# EAGLE design CAN Traffic Teensy 3.5 rev1 (EAGLE 9.6.2)
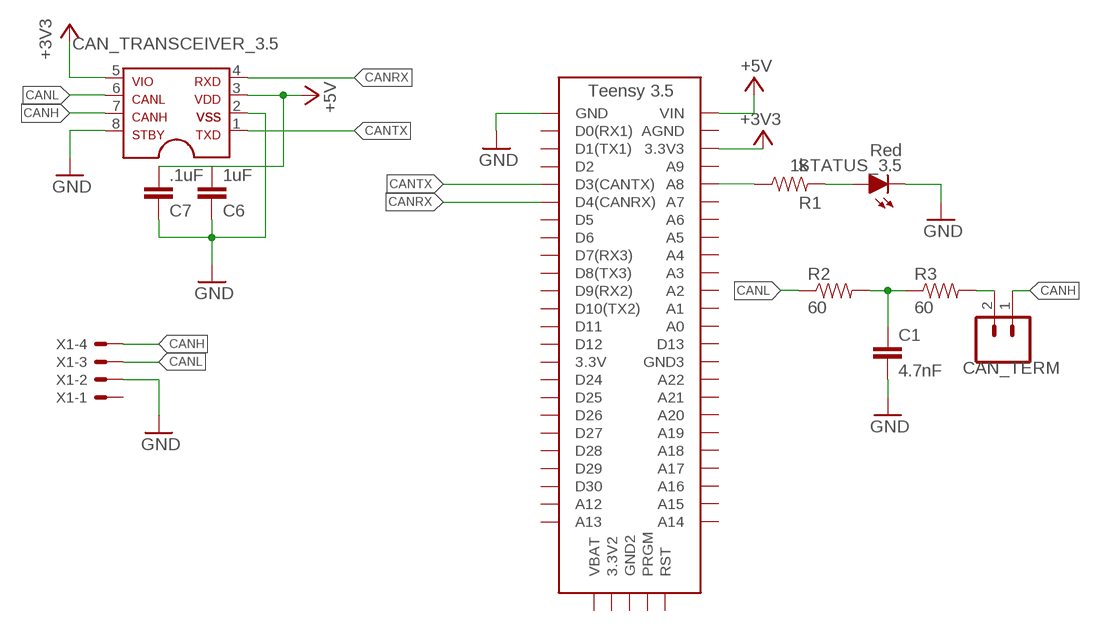
[diagram p0: schematic, sheet 1]

## Parts
3.5  TEENSY_3.5_EXT_RTC  [TEENSY_3.5_EXT_RTC]
C1  4.7nF  CAP0603-CAP  [0603-CAP]
C6  1uF  CAP0603-CAP  [0603-CAP]
C7  .1uF  CAP0603-CAP  [0603-CAP]
CAN_TERM  M02_SLIM  [1X02_SLIM]
CAN_TRANSCEIVER_3.5  MCP2562SOIC-08  [SOIC-08]
R1  1k  RESISTOR0603-RES  [0603-RES]
R2  60  RESISTOR0603-RES  [0603-RES]
R3  60  RESISTOR0603-RES  [0603-RES]
STATUS_3.5  Red  LED-0603  [LED-603]
X1  CONNECTOR-4NANO-FIT_RIGHT_ANGLE-4-SURFACE  [NANO-FIT_RIGHT_ANGLE-4-SURFACE]

## Nets
+3V3: 3.5.3.3V3 CAN_TRANSCEIVER_3.5.5
+5V: 3.5.VIN C6.1 C7.1 CAN_TRANSCEIVER_3.5.3
CANH: CAN_TERM.1 CAN_TRANSCEIVER_3.5.7 X1.4
CANL: CAN_TRANSCEIVER_3.5.6 R2.1 X1.3
CANRX: 3.5.D4(CANRX) CAN_TRANSCEIVER_3.5.4
CANTX: 3.5.D3(CANTX) CAN_TRANSCEIVER_3.5.1
GND: 3.5.GND C1.2 C6.2 C7.2 CAN_TRANSCEIVER_3.5.2 CAN_TRANSCEIVER_3.5.8 STATUS_3.5.C X1.2
N$1: 3.5.A8 R1.1
N$2: C1.1 R2.2 R3.1
N$3: R1.2 STATUS_3.5.A
N$5: CAN_TERM.2 R3.2
Unconnected: 3.5.3.3V 3.5.3.3V2 3.5.A0 3.5.A1 3.5.A2 3.5.A3 3.5.A4 3.5.A5 3.5.A6 3.5.A7 3.5.A9 3.5.A12 3.5.A13 3.5.A14 3.5.A15 3.5.A16 3.5.A17 3.5.A18 3.5.A19 3.5.A20 3.5.A21 3.5.A22 3.5.AGND 3.5.D0(RX1) 3.5.D1(TX1) 3.5.D2 3.5.D5 3.5.D6 3.5.D7(RX3) 3.5.D8(TX3) 3.5.D9(RX2) 3.5.D10(TX2) 3.5.D11 3.5.D12 3.5.D13 3.5.D24 3.5.D25 3.5.D26 3.5.D27 3.5.D28 3.5.D29 3.5.D30 3.5.GND2 3.5.GND3 3.5.PRGM 3.5.RST 3.5.VBAT X1.1

## Library data of the parts
3.5 = HyTechDevices:TEENSY_3.5_EXT_RTC: Extended version of the Teensy 3.5 board that only uses the 2 main rows of pins, plus the perpendicular row with VBat.
C1 C6 C7 = HyTechDevices:CAP: Capacitor Standard 0603 ceramic capacitor, and 0.1" leaded capacitor.
CAN_TERM = HyTechDevices:M02: Standard 2-pin 0.1" header. NOTES ON THE VARIANTS LOCK and LOCK_LONGPADS... This footprint was designed to help hold the alignment of a through-hole component (i.e. 6-pin header) while soldering it into place. You may notice that each hole has been shifted either up or down by 0.005 of an inch from it's more standard position (which is a perfectly straight line). This slight alteration caused the pins (the squares in the middle) to touch the edges of the holes. Because they are alternating, it causes a "brace" to hold the component in place. 0.005 has proven to be the perfect amount of "off-center" position when using our standard breakaway headers. Although looks a little odd when you look at the bare footprint, once you have a header in there, the alteration is very hard to notice. Also,if you push a header all the way into place, it is covered up entirely on the bottom side. This idea of altering the position of holes to aid alignment will be further integrated into the Sparkfun Library for other footprints. It can help hold any component with 3 or more connection pins. Note: The Sparkfun version includes many other packages including surface mount that may be of future interest. Source: Sparkfun <https://github.com/sparkfun/SparkFun-Eagle-Libraries>
CAN_TRANSCEIVER_3.5 = HyTechDevices:MCP2562: MCP2562 High-speed CAN Transceiver Datatsheet <http://ww1.microchip.com/downloads/en/devicedoc/20005167c.pdf>
R1-R3 = HyTechDevices:RESISTOR: Resistor Basic schematic elements and footprints for 0603, 1206, and PTH resistors.
STATUS_3.5 = HyTechDevices:LED: Light Emitting Diode (LED) Source: Dangerous Prototypes Eagle Library <https://github.com/DangerousPrototypes/Eagle_Part_Library>
X1 = HyTechDevices:CONNECTOR-4: Mini-Fit Junior connector 4 pole Source: http://www.molex.com

## Board
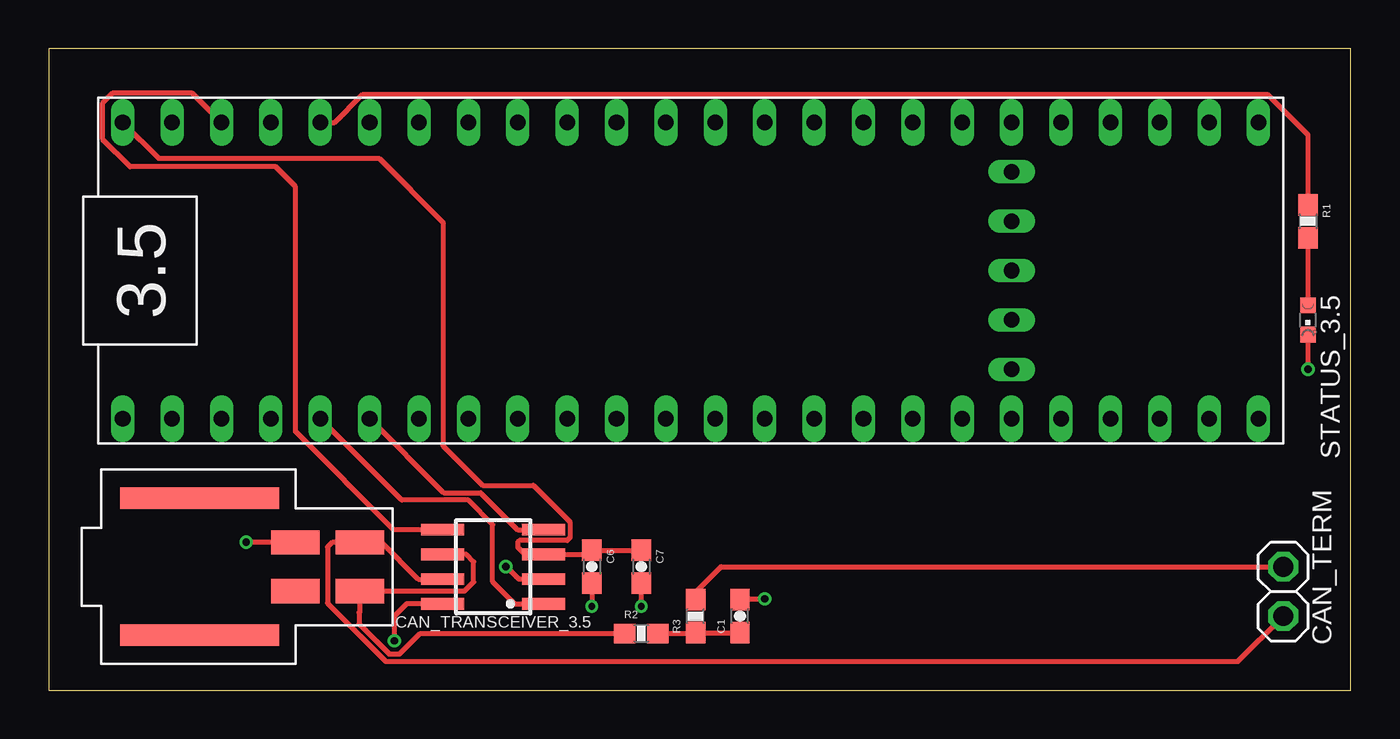
[diagram p1: board, top side]
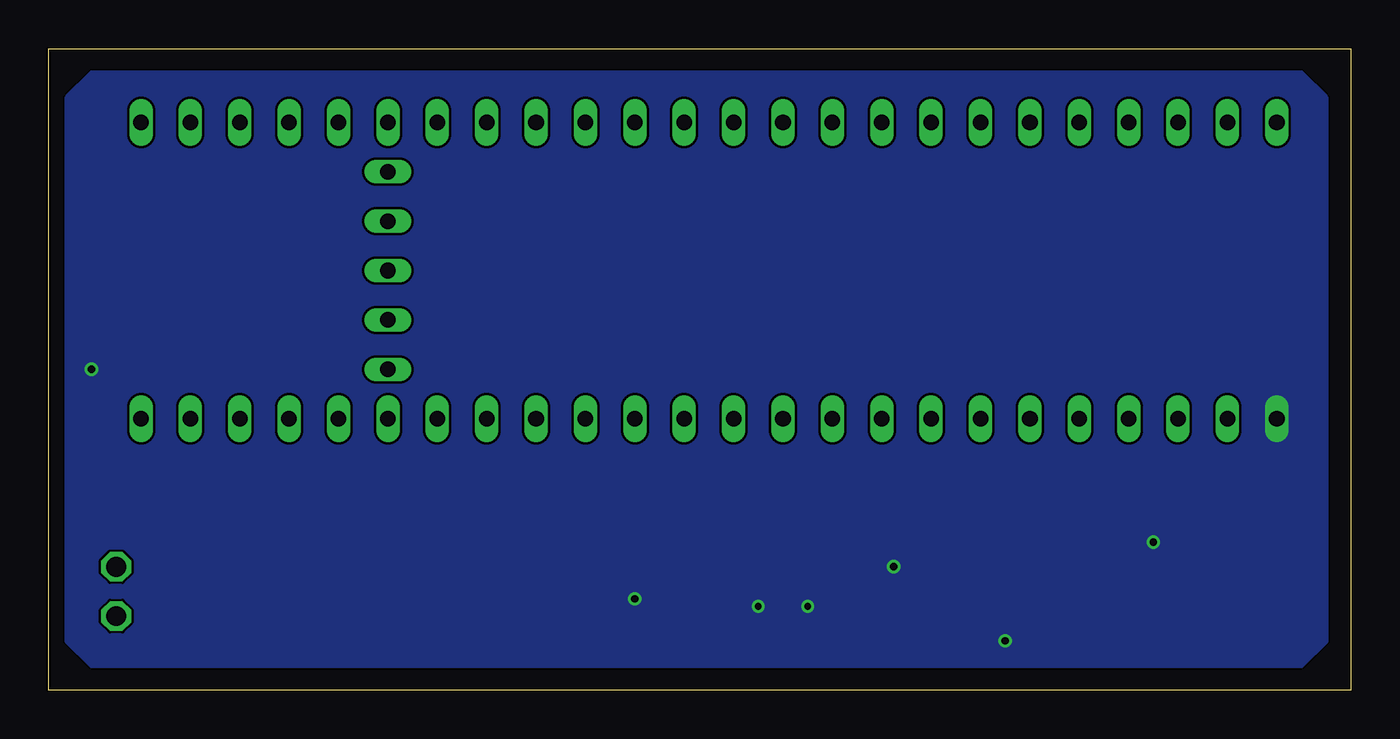
[diagram p2: board, bottom side, seen from below]

Size 66.98 x 33.01 mm. Coordinates in mm from the lower left corner, seen from the top.
Outline: 0,0 66.98,0 66.98,33.01 0,33.01 0,0
Copper layers (1*16): Top 0.035mm / dielectric 1.53mm / Bottom 0.035mm
Design rules "JLCPCB (2 Layer)": minimum track width 5mil, minimum drill 0.3mm, track to track 5mil, track to pad 5mil, pad to pad 5mil, via to via 20mil, smd to smd 5mil, copper to edge 0.2mm, drill to drill 21mil, minimum pad ring 6mil, minimum via ring 6mil, stop-mask expansion 6mil, vias tented up to drill 30mil, thermal gap 10mil

### Footprints (pad centres in the part's own frame; a part is rotated, then mirrored left to right if it is on the bottom)
TEENSY_3.5_EXT_RTC = drill 0.8 long: 3.3V 1.27,24.13; 3.3V2 6.35,13.97; 3.3V3 16.51,54.61; A0 16.51,29.21; A1 16.51,31.75; A2 16.51,34.29; A3 16.51,36.83; A4 16.51,39.37; A5 16.51,41.91; A6 16.51,44.45; A7 16.51,46.99; A8 16.51,49.53; A9 16.51,52.07; A12 1.27,3.81; A13 1.27,1.27; A14 16.51,1.27; A15 16.51,3.81; A16 16.51,6.35; A17 16.51,8.89; A18 16.51,11.43; A19 16.51,13.97; A20 16.51,16.51; A21 16.51,19.05; A22 16.51,21.59; AGND 16.51,57.15; D0(RX1) 1.27,57.15; D1(TX1) 1.27,54.61; D2 1.27,52.07; D3(CANTX) 1.27,49.53; D4(CANRX) 1.27,46.99; D5 1.27,44.45; D6 1.27,41.91; D7(RX3) 1.27,39.37; D8(TX3) 1.27,36.83; D9(RX2) 1.27,34.29; D10(TX2) 1.27,31.75; D11 1.27,29.21; D12 1.27,26.67; D13 16.51,26.67; D24 1.27,21.59; D25 1.27,19.05; D26 1.27,16.51; D27 1.27,13.97; D28 1.27,11.43; D29 1.27,8.89; D30 1.27,6.35; GND 1.27,59.69; GND2 8.89,13.97; GND3 16.51,24.13; PRGM 11.43,13.97; RST 13.97,13.97; VBAT 3.81,13.97; VIN 16.51,59.69
0603-CAP = smd 1.1 x 1: 1 -0.85,0; 2 0.85,0
1X02_SLIM = drill 1.016 octagon: 1 -1.27,0; 2 1.27,0
SOIC-08 = smd 0.6 x 2.2: 1 -1.905,-2.6; 2 -0.635,-2.6; 3 0.635,-2.6; 4 1.905,-2.6; 5 1.905,2.6; 6 0.635,2.6; 7 -0.635,2.6; 8 -1.905,2.6
0603-RES = smd 1.1 x 1: 1 -0.85,0; 2 0.85,0
LED-603 = smd 0.8 x 0.8: A 0,-0.75; C 0,0.75
NANO-FIT_RIGHT_ANGLE-4-SURFACE = smd 1.24 x 2.5: 1 1.25,0; 2 -1.25,0; 3 1.25,3.3; 4 -1.25,3.3 | smd 1.1 x 8.2: P$5 -3.52,-4.93; P$6 3.52,-4.93

### Placement (x,y rotation side)
3.5  63.5,12.7 90 top
C1  35.56,3.81 90 top
C6  27.94,6.35 270 top
C7  30.48,6.35 270 top
CAN_TERM  63.5,5.08 90 top
CAN_TRANSCEIVER_3.5  22.86,6.35 90 top
R1  64.77,24.13 270 top
R2  30.48,2.92 0 top
R3  33.27,3.81 90 top
STATUS_3.5  64.77,19.05 180 top
X1  12.7,6.35 270 top

### Tracks (layer width: path | path; a pad name or v marks a point on that pad's centre or on a via)
+3V3
  Top 0.254: CAN_TRANSCEIVER_3.5.5 17.75,8.26 12.7,13.3 12.7,25.91 11.68,26.92 4.19,26.92 2.79,28.32 2.79,30.23 3.3,30.73 7.37,30.73 3.5.3.3V3
+5V
  Top 0.254: C7.1 C6.1 27.73,6.99 CAN_TRANSCEIVER_3.5.3 25.33,6.86 24.64,6.86 24.13,7.37 24.13,7.62 24.21,7.7 26.66,7.7 26.81,7.85 26.81,8.66 24.93,10.54 22.32,10.54 20.29,12.58 20.29,24.07 16.99,27.36 5.66,27.36 3.5.VIN
CANH
  Top 0.254: CAN_TRANSCEIVER_3.5.7 19.01,5.71 17.12,7.6 X1.4 14.59,7.6 14.35,7.37 14.35,4.48 17.34,1.49 61.18,1.49 CAN_TERM.1
CANL
  Top 0.254: CAN_TRANSCEIVER_3.5.6 21.49,6.99 21.87,6.6 21.87,5.56 21.4,5.1 X1.3 16,4.03 15.96,3.99 15.96,3.4 17.5,1.87 18.06,1.87 19.11,2.92 R2.1
CANRX
  Top 0.254: 3.5.D4(CANRX) 20.32,10.16 22.23,10.16 24.13,8.26 CAN_TRANSCEIVER_3.5.4
CANTX
  Top 0.254: 3.5.D3(CANTX) 18.16,9.78 21.59,9.78 22.84,8.52 22.84,5.56 23.73,4.68 23.96,4.45 CAN_TRANSCEIVER_3.5.1
GND  (via drill 0.35, 0.38)
  Top 0.254: C6.2 v27.94,4.32 | C7.2 v30.48,4.32 | CAN_TRANSCEIVER_3.5.2 24.19,5.71 23.55,6.35 v23.52,6.35 | CAN_TRANSCEIVER_3.5.8 18.41,4.45 17.78,3.81 v17.78,2.54 | X1.2 10.18,7.6 v10.16,7.62 | STATUS_3.5.C v64.77,16.51 | C1.2 35.6,4.7 v36.83,4.7
  pour Bottom (no thermals): 2.54,31.75 64.77,31.75 66.04,30.48 66.04,2.54 64.77,1.27 2.54,1.27 1.27,2.54 1.27,30.48
N$1
  Top 0.254: 3.5.A8 14.7,29.21 16.16,30.66 62.68,30.66 64.77,28.57 R1.1
N$2
  Top 0.254: R2.2 33.23,2.92 R3.1 C1.1
N$3
  Top 0.254: R1.2 STATUS_3.5.A
N$5
  Top 0.254: R3.2 33.27,5.04 34.58,6.35 CAN_TERM.2

### Text on the board
tDocu: TEENSY 3.5